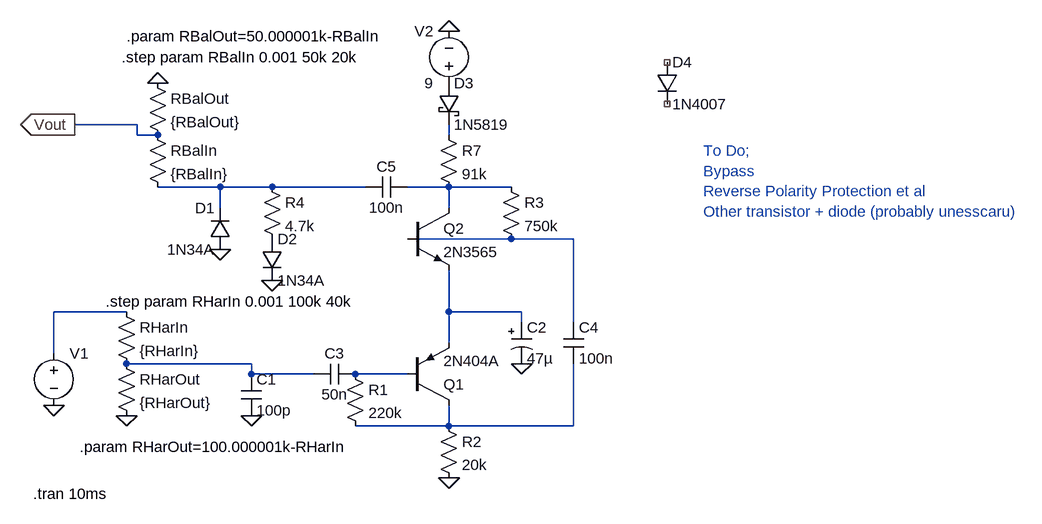
[diagram p0: schematic HarmonicPerculator.asc]
HarmonicPerculator.asc, the LTspice schematic file:
Version 4
SHEET 1 1556 680
WIRE 144 -208 48 -208
WIRE 144 -192 144 -208
WIRE 176 -192 144 -192
WIRE 624 -192 624 -208
WIRE 272 -112 176 -112
WIRE 352 -112 272 -112
WIRE 496 -112 352 -112
WIRE 624 -112 560 -112
WIRE 720 -112 624 -112
WIRE 272 -80 272 -112
WIRE 624 -80 624 -112
WIRE 720 -32 560 -32
WIRE 816 -32 720 -32
WIRE 128 80 16 80
WIRE 624 80 624 16
WIRE 736 80 624 80
WIRE 736 96 736 80
WIRE 816 96 816 -32
WIRE 624 128 624 80
WIRE 16 144 16 80
WIRE 320 160 128 160
WIRE 320 176 320 160
WIRE 416 176 320 176
WIRE 560 176 480 176
WIRE 624 256 624 224
WIRE 624 256 480 256
WIRE 816 256 816 160
WIRE 816 256 624 256
FLAG 320 240 0
FLAG 624 336 0
FLAG 736 160 0
FLAG 352 32 0
FLAG 272 -16 0
FLAG 624 -352 0
FLAG 48 -208 Vout
IOPIN 48 -208 Out
FLAG 16 224 0
FLAG 128 240 0
FLAG 176 -272 0
DATAFLAG 16 128 ""
SYMBOL cap 304 176 R0
SYMATTR InstName C1
SYMATTR Value 100p
SYMBOL cap 480 160 R90
WINDOW 0 0 32 VBottom 2
WINDOW 3 32 32 VTop 2
SYMATTR InstName C3
SYMATTR Value 50n
SYMBOL res 464 160 R0
SYMATTR InstName R1
SYMATTR Value 220k
SYMBOL res 608 240 R0
SYMATTR InstName R2
SYMATTR Value 20k
SYMBOL polcap 720 96 R0
SYMATTR InstName C2
SYMATTR Value 47µ
SYMBOL cap 800 96 R0
SYMATTR InstName C4
SYMATTR Value 100n
SYMBOL res 704 -128 R0
SYMATTR InstName R3
SYMATTR Value 750k
SYMBOL voltage 624 -256 R180
WINDOW 0 24 96 Left 2
WINDOW 3 24 16 Left 2
WINDOW 123 0 0 Left 0
WINDOW 39 0 0 Left 0
SYMATTR InstName V2
SYMATTR Value 9
SYMBOL diode 288 -16 R180
WINDOW 0 24 64 Left 2
WINDOW 3 24 0 Left 2
SYMATTR InstName D1
SYMATTR Value 1N34A
SYMBOL res 336 -128 R0
SYMATTR InstName R4
SYMATTR Value 4.7k
SYMBOL diode 336 -32 R0
SYMATTR InstName D2
SYMATTR Value 1N34A
SYMBOL cap 560 -128 R90
WINDOW 0 0 32 VBottom 2
WINDOW 3 32 32 VTop 2
SYMATTR InstName C5
SYMATTR Value 100n
SYMBOL voltage 16 128 R0
WINDOW 123 0 0 Left 0
WINDOW 39 0 0 Left 0
WINDOW 3 24 96 Invisible 2
SYMATTR Value SINE(0 0.1 440)
SYMATTR InstName V1
SYMBOL res 112 64 R0
SYMATTR InstName RHarIn
SYMATTR Value {RHarIn}
SYMBOL res 112 144 R0
SYMATTR InstName RHarOut
SYMATTR Value {RHarOut}
SYMBOL res 608 -208 R0
SYMATTR InstName R7
SYMATTR Value 91k
SYMBOL res 160 -208 R0
SYMATTR InstName RBalIn
SYMATTR Value {RBalIn}
SYMBOL res 160 -288 R0
SYMATTR InstName RBalOut
SYMATTR Value {RBalOut}
SYMBOL npn 560 -80 R0
SYMATTR InstName Q2
SYMATTR Value 2N3565
SYMBOL schottky 608 -272 R0
SYMATTR InstName D3
SYMATTR Value 1N5819
SYMATTR Description Diode
SYMATTR Type diode
SYMBOL diode 944 -304 R0
SYMATTR InstName D4
SYMATTR Value 1N4007
SYMBOL pnp 560 224 M180
SYMATTR InstName Q1
SYMATTR Value 2N404A
TEXT -16 360 Left 2 !.tran 10ms
TEXT 96 64 Left 2 !.step param RHarIn 0.001 100k 40k
TEXT 56 288 Left 2 !.param RHarOut=100.000001k-RHarIn
TEXT 120 -312 Left 2 !.step param RBalIn 0.001 50k 20k
TEXT 128 -344 Left 2 !.param RBalOut=50.000001k-RBalIn
TEXT 1016 -168 Left 2 ;To Do;\nBypass\nReverse Polarity Protection et al\nOther transistor + diode (probably unesscaru)

The netlist it stands for:
* HarmonicPerculator.asc
C1 N007 0 100p
C3 N008 N007 50n
R1 N008 N009 220k
R2 N009 0 20k
C2 N006 0 47µ
C4 N004 N009 100n
R3 N003 N004 750k
V2 P001 0 9
D1 0 N002 1N34A
R4 N002 P002 4.7k
D2 P002 0 1N34A
C5 N003 N002 100n
V1 N005 0 SINE(0 0.1 440)
RHarIn N005 N007 {RHarIn}
RHarOut N007 0 {RHarOut}
R7 N001 N003 91k
RBalIn Vout N002 {RBalIn}
RBalOut 0 Vout {RBalOut}
Q2 N003 N004 N006 0 2N3565
D3 P001 N001 1N5819
D4 NC_01 NC_02 1N4007
Q1 N009 N008 N006 0 2N404A
.model D D
.lib standard.dio
.model NPN NPN
.model PNP PNP
.lib standard.bjt
.tran 10ms
.step param RHarIn 0.001 100k 40k
.param RHarOut=100.000001k-RHarIn
.step param RBalIn 0.001 50k 20k
.param RBalOut=50.000001k-RBalIn
* To Do;
* Bypass
* Reverse Polarity Protection et al
* Other transistor + diode (probably unesscaru)
.backanno
.end